# Altium schematic sheet BlinkBoard.SchDoc
size A; Author: MAKinteract; Revision: 1; SheetNumber: 1; SheetTotal: 3
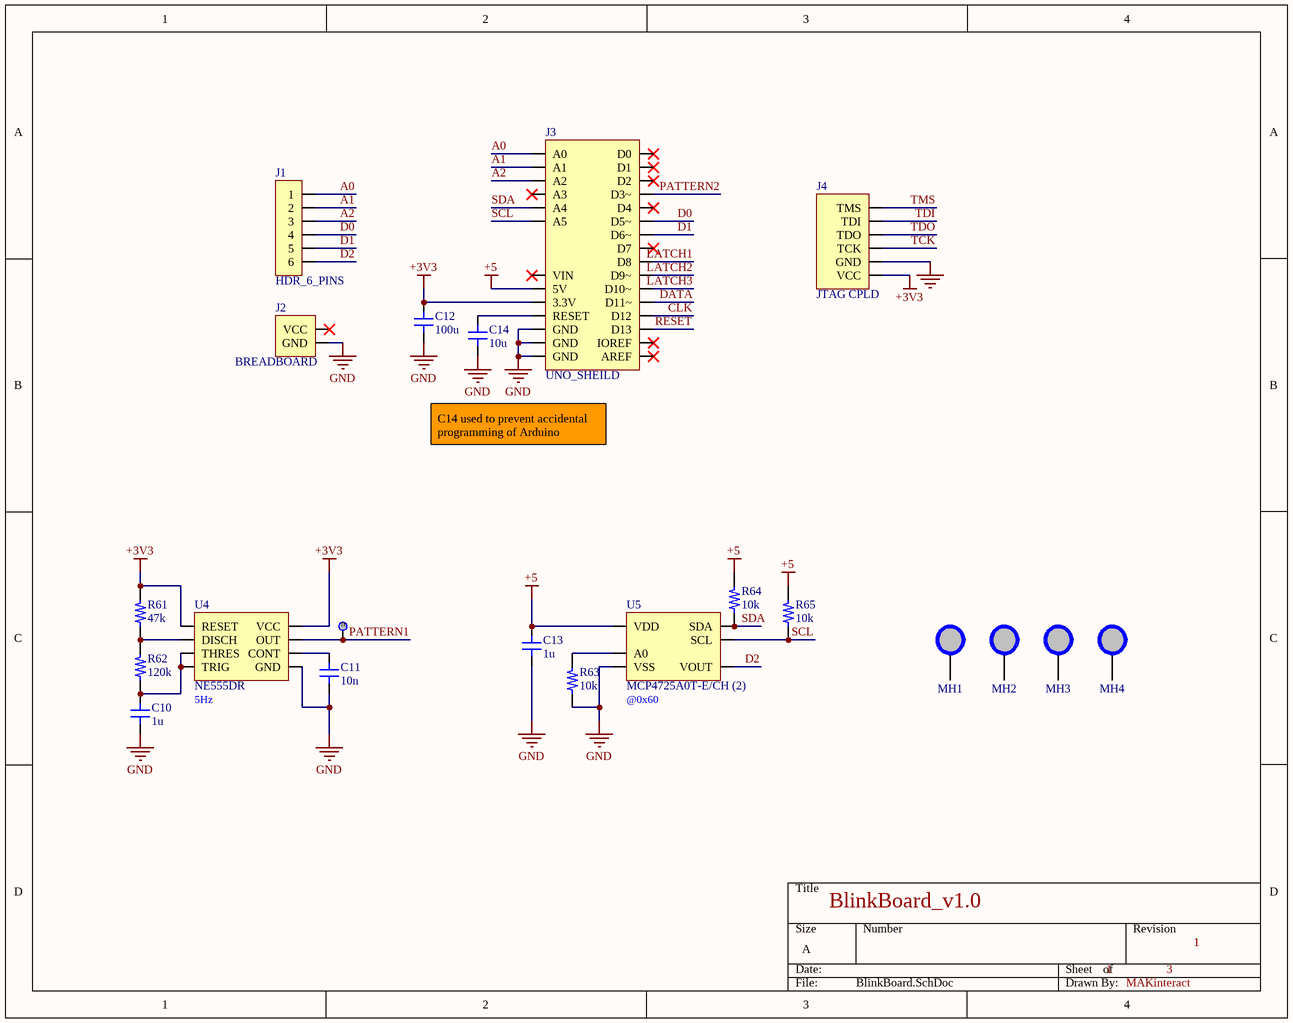
[diagram p0: BlinkBoard.SchDoc]

## Parts
C10  1u  [C0805]
C11  10n  [C0402]
C12  100u  [C1206]
C13  1u  [C0805]
C14  10u  [C0805]
J1  HDR_6_PINS  [HDR6_100mil]  (no BOM)
J2  BREADBOARD  [BREADBOARD]  (no BOM)
J3  UNO_SHEILD  [ARDUINO_UNO_SHIELD]  (no BOM)
J4  JTAG CPLD  [JTAG]  (no BOM)
MH1  MH 3.2mm NP  [MH3.2MM]  (value not drawn)  (no BOM)
MH2  MH 3.2mm NP  [MH3.2MM]  (value not drawn)  (no BOM)
MH3  MH 3.2mm NP  [MH3.2MM]  (value not drawn)  (no BOM)
MH4  MH 3.2mm NP  [MH3.2MM]  (value not drawn)  (no BOM)
R61  47k  [RES0402]
R62  120k  [RES0402]
R63  10k  [RES0402]
R64  10k  [RES0402]
R65  10k  [RES0402]
TP1  TEST POINT  [TEST POINT]  (value not drawn)  (no BOM)
U4  NE555DR  [8-SOIC]
U5  MCP4725A0T-E/CH (2)  [SOT23-6]

## Nets
+3V3: C12.2 J3.27(3.3V) J4.6(VCC) R61.2 U4.4(RESET) U4.8(VCC)
+5: C13.2 J3.26(5V) R64.2 R65.2 U5.3(VDD)
GND: C10.1 C11.1 C12.1 C13.1 C14.1 J2.2(GND) J3.15(GND) J3.24(GND) J3.25(GND) J4.5(GND) R63.1 U4.1(GND) U5.2(VSS)
A0: J1.1 J3.22(A0)
A1: J1.2 J3.21(A1)
A2: J1.3 J3.20(A2)
CLK: J3.13(D12)
D0: J1.4 J3.6(D5~)
D1: J1.5 J3.7(D6~)
D2: J1.6 U5.1(VOUT)
DATA: J3.12(D11~)
LATCH1: J3.9(D8)
LATCH2: J3.10(D9~)
LATCH3: J3.11(D10~)
PATTERN1: TP1.1 U4.3(OUT)
PATTERN2: J3.4(D3~)
RESET: J3.14(D13)
SCL: J3.17(A5) R65.1 U5.5(SCL)
SDA: J3.18(A4) R64.1 U5.4(SDA)
TCK: J4.4(TCK)
TDI: J4.2(TDI)
TDO: J4.3(TDO)
TMS: J4.1(TMS)
NetC10_2: C10.2 R62.1 U4.2(TRIG) U4.6(THRES)
NetC11_2: C11.2 U4.5(CONT)
NetC14_2: C14.2 J3.28(RESET)
NetR61_1: R61.1 R62.2 U4.7(DISCH)
NetR63_2: R63.2 U5.6(A0)

Not connected (* = marked no-connect by the designer): J2 1(VCC)*; J3 1(D0)* 2(D1)* 3(D2)* 5(D4)* 8(D7)* 16(AREF)* 19(A3)* 23(VIN)* 29(IOREF)*; MH1 1; MH2 1; MH3 1; MH4 1

## Notes on the sheet
- C14 used to prevent accidental programming of Arduino
- (near U4) 5Hz
- (near U5) @0x60
- BlinkBoard_v1.0
- (in symbol TEST POINT) TP

## Library data of the parts
C10 C13 = C0805_1u: CERAMIC CAPACITOR, 1UF, 25V, Y5V, +80, -20%, 0805, FULL REEL; Product Range:CC Series; Capacitance:1 F; Capacitance Tolerance:+80%, -20%; Dielectric Characteristic:Y5V; Voltage Rating:25V; Ceramic Capacitor Case:0805 [2012 Metric] ;RoHS Compliant: Yes; Manufacturer: Yageo; Manufacturer Part Number: CC0805ZRY5V8BB105; Tolerance: 80%; Supplier 1: Digi-Key; Stock 1: 144647; RoHS: Yes; Mount: Surface Mount; Case/Package: 0805; Weight: 0.000194oz; Case Code (Metric): 2012; Case Code (Imperial): 0805; Min Operating Temperature: -30°C; Max Operating Temperature: 85°C; Package Quantity: 1; Capacitance: 1uF; Voltage Rating: 25V; Packaging: Tape and Reel; Voltage Rating (DC): 25V; Dielectric: Y5V; Termination: SMD/SMT; Composition: Ceramic; Length: 2mm; Height: 0.85mm; Width: 0.049inch; Thickness: 0.033inch; Depth: 1.25mm; Radiation Hardening: No; REACH SVHC: No SVHC; Lead Free: Lead Free; Halogen Free: Halogen Free; ComponentLink6URL: https://datasheet.ciiva.com/28450/1132289-28450860.pdf?src-supplier=Element14; ComponentLink6Description: https://datasheet.ciiva.com/28450/1132289-28450860.pdf?src-supplier=Element14; Supplier Part Number 1: 311-1358-6-ND; Pricing 1: 1 = 0.16000, 10 = 0.11400, 100 = 0.05340, 500 = 0.03748, 1000 = 0.03102 (USD)
C11 = C0402_10n: Cap Ceramic 0.01uF 10V X7R 10% SMD 0402 125C Paper T/R; Manufacturer: Yageo; Manufacturer Part Number: CC0402KRX7R6BB103; Capacitance: 10nF; Supplier 1: Digi-Key; Stock 1: 16677; RoHS: Yes; Mount: Surface Mount; Case/Package: 0402; Weight: 2.3E-05oz; Case Code (Imperial): 0402; Case Code (Metric): 1005; Min Operating Temperature: -55°C; Max Operating Temperature: 125°C; Packaging: Tape and Reel; Tolerance: 10%; Voltage Rating (DC): 10V; Dielectric: X7R; Termination: SMD/SMT; Composition: Ceramic; Voltage Rating: 10V; Length: 1mm; Width: 0.02inch; Thickness: 0.022inch; Depth: 0.5mm; Radiation Hardening: No; Lead Free: Lead Free; Halogen Free: Halogen Free; ComponentLink1URL: https://datasheet.ciiva.com/26862/getdatasheetpartid-748492-26862629.pdf?src-supplier=Verical; ComponentLink1Description: https://datasheet.ciiva.com/26862/getdatasheetpartid-748492-26862629.pdf?src-supplier=Verical; Supplier Part Number 1: 311-1703-6-ND; Pricing 1: 1 = 0.10000, 10 = 0.02100, 100 = 0.00950, 500 = 0.00678, 1000 = 0.00532, 2500 = 0.00484, 5000 = 0.00445 (USD)
C12 = C1206_100u: 1206 6.3 V 100 uF ±20% Tolerance X6T Monolithic Ceramic Chip Capacitor; Manufacturer: Murata; Manufacturer Part Number: GRM31CD80J107ME39K; Voltage Rating (DC): 6.3V; Capacitance: 100uF; Supplier 1: Digi-Key; Stock 1: 13511; RoHS: No; Dielectric: X6T; Tolerance: 20%; Length: 3.2mm; Width: 1.6mm; Thickness: 1.6mm; ComponentLink1URL: http://search.murata.co.jp/Ceramy/image/img/A01X/G101/ENG/GRM31CD80J107ME39-01.pdf?src-supplier=Digi-Key; ComponentLink1Description: http://search.murata.co.jp/Ceramy/image/img/A01X/G101/ENG/GRM31CD80J107ME39-01.pdf?src-supplier=Digi-Key; ComponentLink2URL: https://search.murata.co.jp/Ceramy/image/img/A01X/G101/ENG/GRM31CD80J107ME39-01.pdf?src-supplier=Digi-Key; ComponentLink2Description: https://search.murata.co.jp/Ceramy/image/img/A01X/G101/ENG/GRM31CD80J107ME39-01.pdf?src-supplier=Digi-Key; Supplier Part Number 1: 490-16313-6-ND; Pricing 1: 1 = 0.73000, 10 = 0.53700, 50 = 0.42920, 100 = 0.36790, 500 = 0.29128, 1000 = 0.24529, 2500 = 0.22996 (USD)
C14 = C0804_10u: Cap Ceramic 10uF 6.3V X5R 10% SMD 0805 85C Paper T/R; Manufacturer: Yageo; Manufacturer Part Number: CC0805KRX5R5BB106; Supplier 1: Digi-Key; Stock 1: 6744; RoHS: Yes; Mount: Surface Mount; Case/Package: 0805; Case Code (Imperial): 0805; Case Code (Metric): 2012; Min Operating Temperature: -55°C; Max Operating Temperature: 85°C; Capacitance: 10uF; Tolerance: 10%; Voltage Rating: 6.3V; Voltage Rating (DC): 6.3V; Packaging: Tape and Reel; Dissipation Factor: 10%; Dielectric: X5R; Termination: SMD/SMT; Composition: Ceramic; Length: 2mm; Height: 1.25mm; Width: 0.049inch; Thickness: 0.053inch; Depth: 1.25mm; Radiation Hardening: No; Lead Free: Lead Free; Halogen Free: Halogen Free; REACH SVHC: Unknown; ComponentLink1URL: https://datasheet.ciiva.com/17436/upy-gphc-x5r-4v-to-50v-12-17436602.pdf?src-supplier=Avnet+Europe; ComponentLink1Description: https://datasheet.ciiva.com/17436/upy-gphc-x5r-4v-to-50v-12-17436602.pdf?src-supplier=Avnet+Europe; Supplier Part Number 1: 311-2084-6-ND; Pricing 1: 1 = 0.20000, 10 = 0.13600, 50 = 0.08180, 100 = 0.06910, 500 = 0.04730, 1000 = 0.04185 (USD)
J1 = H_ARDUPINS: Sockets to connect to Arduino pins
J2 = BREADBOARD: 26*2 ROWS
J3 = ARDUINO_UNO_SHIELD: Arduino UNO shield; Manufacturer Part Number: A000073; Evaluation Kit: Yes; Number of Bits: 8; Core Architecture: AVR; Supplier 1: Digi-Key; Manufacturer: Arduino; Stock 1: 2726; RoHS: Yes; Mount: Surface Mount; Weight: 0.02lb; Package Quantity: 1; Packaging: Bulk; Length: 3inch; Height: 0.05inch; Width: 2.5inch; REACH SVHC: Unknown; ComponentLink6URL: https://datasheet.ciiva.com/20168/73-4443-20168541.pdf?src-supplier=Rapid+Electronics; ComponentLink6Description: https://datasheet.ciiva.com/20168/73-4443-20168541.pdf?src-supplier=Rapid+Electronics; Supplier Part Number 1: 1050-1041-ND; Pricing 1: 1 = 20.90000 (USD)
J4 = H_JTAG: Socket to connect to JTAG
MH1-MH4 = MHNP: Mounting hole 3.2mm non plated
R61 = R0402_47K: YAGEO - RC0402JR-0747KL - SMD Chip Resistor, 0402 [1005 Metric], 47 kohm, RC Series, 50 V, Thick Film, 63 mW; Resistance: 47kR; Power Rating: 63mW; Tolerance: 5%; Voltage Rating: 50V; Temperature Coefficient: 100ppm/°C; Supplier 1: Digi-Key; Manufacturer: Yageo; Manufacturer Part Number: RC0402JR-0747KL; Stock 1: 4044309; RoHS: Yes; Case/Package: 0402; Case Code (Metric): 1005; Case Code (Imperial): 0402; Min Operating Temperature: -55°C; Max Operating Temperature: 155°C; Package Quantity: 1; Packaging: Tape and Reel; Composition: Thick Film; Number of Terminations: 2; Termination: SMD/SMT; Military Standard: Not; Max Power Dissipation: 63mW; Features: Moisture Resistant; Working Voltage: 50V; Length: 1mm; Height: 0.016inch; Width: 0.02inch; Depth: 0.5mm; REACH SVHC: Unknown; Lead Free: Lead Free; ComponentLink8URL: https://datasheet.ciiva.com/16740/pyu-rc0402-51-rohs-l-6-r-16740971.pdf?src-supplier=Future+Electronics; ComponentLink8Description: https://datasheet.ciiva.com/16740/pyu-rc0402-51-rohs-l-6-r-16740971.pdf?src-supplier=Future+Electronics; Supplier Part Number 1: 311-47KJRDKR-ND; Pricing 1: 1 = 0.10000, 10 = 0.01300, 100 = 0.00530, 1000 = 0.00236, 2500 = 0.00205, 5000 = 0.00169 (USD)
R62 = R0402_120K: RES SMD 120K OHM 5% 1/16W 0402; Manufacturer: Yageo; Manufacturer Part Number: RC0402JR-07120KL; Resistance: 120kR; Power Rating: 63mW; Voltage Rating: 50V; Temperature Coefficient: 100ppm/°C; Supplier 1: Digi-Key; Stock 1: 102829; RoHS: Yes; Case/Package: 0402; Number of Pins: 2; Case Code (Imperial): 0402; Case Code (Metric): 1005; Min Operating Temperature: -55°C; Max Operating Temperature: 155°C; Tolerance: 5%; Packaging: Tape and Reel; Voltage Rating (DC): 50V; Package Quantity: 10000; Termination: SMD/SMT; Composition: Thick Film; Military Standard: Not; Length: 1mm; Height: 0.35mm; Width: 0.5mm; Depth: 0.5mm; REACH SVHC: No SVHC; Lead Free: Lead Free; ComponentLink1URL: https://datasheet.ciiva.com/7850/1018594-7850140.pdf?src-supplier=Element14; ComponentLink1Description: https://datasheet.ciiva.com/7850/1018594-7850140.pdf?src-supplier=Element14; ComponentLink2URL: https://datasheet.ciiva.com/6168/1018594-6168997.pdf?src-supplier=Farnell; ComponentLink2Description: https://datasheet.ciiva.com/6168/1018594-6168997.pdf?src-supplier=Farnell; ComponentLink3URL: https://datasheet.ciiva.com/7983/1018594-7983545.pdf?src-supplier=Element14; ComponentLink3Description: https://datasheet.ciiva.com/7983/1018594-7983545.pdf?src-supplier=Element14; ComponentLink4URL: https://datasheet.ciiva.com/7850/1018594-7850141.pdf?src-supplier=Element14; ComponentLink4Description: https://datasheet.ciiva.com/7850/1018594-7850141.pdf?src-supplier=Element14; ComponentLink5URL: https://datasheet.ciiva.com/12576/pyu-rc0402-51-rohs-l-6-r-8721-12576174.pdf?src-supplier=Mouser; ComponentLink5Description: https://datasheet.ciiva.com/12576/pyu-rc0402-51-rohs-l-6-r-8721-12576174.pdf?src-supplier=Mouser; Supplier Part Number 1: 311-120KJRDKR-ND; Pricing 1: 1 = 0.10000, 10 = 0.01300, 100 = 0.00530, 1000 = 0.00236, 2500 = 0.00205, 5000 = 0.00169 (USD)
R63-R65 = R0402_10K: RES SMD 10K OHM 1% 1/16W 0402; Manufacturer: Yageo; Manufacturer Part Number: RC0402FR-0710KP; Max Power Dissipation: 63mW; Temperature Coefficient: 150ppm/°C; Resistance: 10kR; Supplier 1: Digi-Key; Stock 1: 24916; RoHS: Yes; Case/Package: 0402; Case Code (Imperial): 0402; Case Code (Metric): 1005; Min Operating Temperature: -55°C; Max Operating Temperature: 155°C; Tolerance: 1%; Packaging: Tape and Reel; Composition: Thick Film; Number of Terminations: 2; Features: Moisture Resistant; Length: 0.039inch; Height: 0.016inch; Width: 0.02inch; ComponentLink1URL: http://www.yageo.com/NewPortal/yageodocoutput?fileName=/pdf/R-Chip/PYu-RC_51_RoHS_P_0.pdf&src-supplier=Digi-Key; ComponentLink1Description: http://www.yageo.com/NewPortal/yageodocoutput?fileName=/pdf/R-Chip/PYu-RC_51_RoHS_P_0.pdf&src-supplier=Digi-Key; Supplier Part Number 1: YAG1249DKR-ND; Pricing 1: 1 = 0.10000, 10 = 0.03500, 100 = 0.01400, 1000 = 0.00631, 2500 = 0.00548, 5000 = 0.00452 (USD)
U4 = 555: TEXAS INSTRUMENTS         NE555DR.             TIMER, SINGLE, 500KHZ, 16V, SOIC-8; Min Supply Voltage: 4.5V; Frequency: 100kHz; Number of Timers/Counters: 1; Operating Supply Current: 10mA; High Level Output Current: -200mA; Low Level Output Current: 200mA; Quiescent Current: 15mA; Supplier 1: Digi-Key; Manufacturer: Texas Instruments; Manufacturer Part Number: NE555DR; Stock 1: 55105; RoHS: Yes; Mount: Surface Mount; Case/Package: SOIC; Number of Pins: 8; Weight: 0.002561oz; Contact Plating: Gold; Min Operating Temperature: 0°C; Max Operating Temperature: 70°C; Max Supply Voltage: 16V; Packaging: Tape and Reel; Package Quantity: 2500; Length: 4.9mm; Height: 1.58mm; Width: 3.91mm; Radiation Hardening: No; REACH SVHC: No SVHC; Lead Free: Lead Free; Supplier Part Number 1: 296-6501-6-ND; Pricing 1: 1 = 0.36000, 10 = 0.27500, 25 = 0.24760, 100 = 0.17100, 250 = 0.14400, 500 = 0.11700, 1000 = 0.09000 (USD); ComponentLink7URL: https://datasheet.ciiva.com/1139/1874740-1139901.pdf?src-supplier=Element14; ComponentLink7Description: https://datasheet.ciiva.com/1139/1874740-1139901.pdf?src-supplier=Element14
U5 = MCP4725A0T: DAC 1-CH Resistor-String 12-bit 6-Pin SOT-23A T/R; Manufacturer: Microchip; Resolution: 12b; Integral Nonlinearity (INL): 14.5LSB; Output Type: Voltage; Interface: I2C,Serial,2-Wire; Settling Time: 6us; Input Offset Voltage (Vos): 1.1mV; Number of Bits: 12; Number of DAC Channels: 1; Max Supply Voltage: 5.5V; Min Supply Voltage: 2.7V; Polarity: Unipolar; Supply Type: Single; Nominal Supply Current: 210uA; Supplier 1: Digi-Key; Manufacturer Part Number: MCP4725A0T-E/CH; Stock 1: 26487; RoHS: Yes; Mount: Surface Mount; Case/Package: SOT-23-6; Number of Pins: 6; Contact Plating: Tin,Matte; Min Operating Temperature: -40°C; Max Operating Temperature: 125°C; Package Quantity: 3000; Packaging: Tape and Reel; Number of Converters: 1; Number of Channels: 1; Number of D/A Converters: 1; Number of Outputs: 1; Termination: SMD/SMT; Length: 3.1mm; Height: 1.3mm; Width: 1.8mm; Radiation Hardening: No; Lead Free: Lead Free; REACH SVHC: No SVHC; ComponentLink10URL: https://datasheet.ciiva.com/1359/22039d-1359789.pdf?src-supplier=Digi-Key; ComponentLink10Description: https://datasheet.ciiva.com/1359/22039d-1359789.pdf?src-supplier=Digi-Key; Supplier Part Number 1: MCP4725A0T-E/CHDKR-ND; Pricing 1: 1 = 0.96000, 25 = 0.80000, 100 = 0.73000 (USD)